# Altium schematic sheet MAX485.SchDoc
size A4
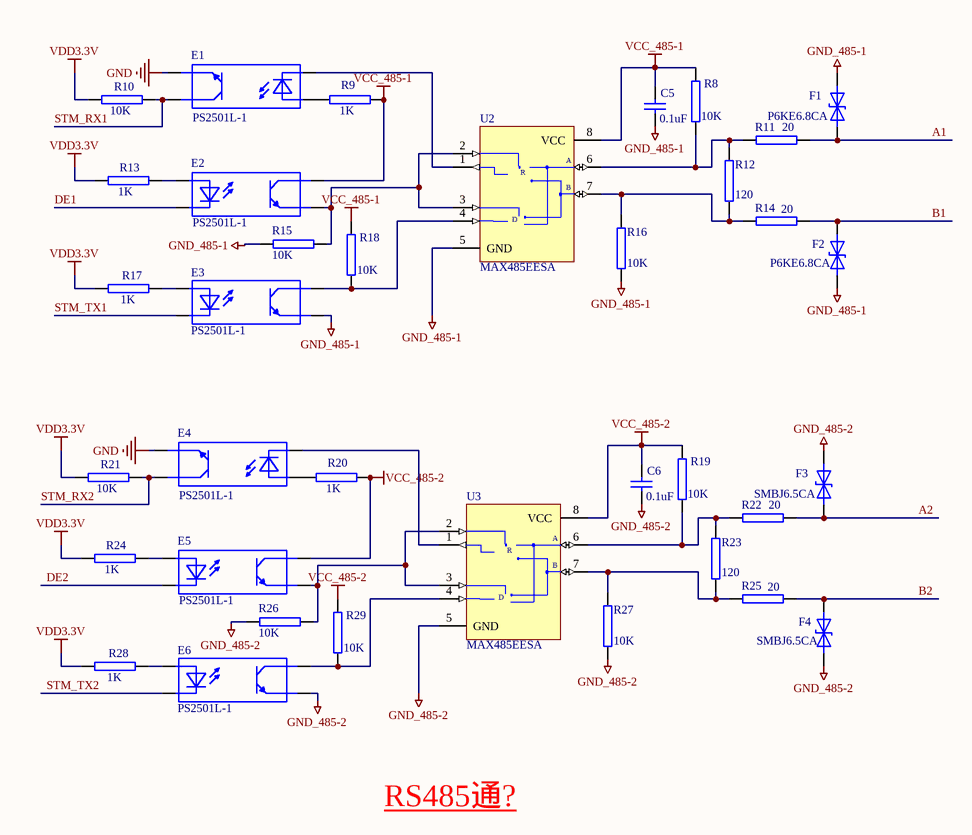
[diagram p0: MAX485.SchDoc]

## Parts
C5  value 0.1uF  [C0805]  (hidden comment: Cap)
C6  value 0.1uF  [C0805]  (hidden comment: Cap)
E1  PS2501L-1  [NEC2501]
E2  PS2501L-1  [NEC2501]
E3  PS2501L-1  [NEC2501]
E4  PS2501L-1  [NEC2501]
E5  PS2501L-1  [NEC2501]
E6  PS2501L-1  [NEC2501]
F1  P6KE6.8CA  [P6KE6,8CA]
F2  P6KE6.8CA  [P6KE6,8CA]
F3  SMBJ6.5CA  [P6KE6,8CA]
F4  SMBJ6.5CA  [P6KE6,8CA]
R8  10K  [0805]
R9  1K  [0805]
R10  10K  [0805]
R11  20  [0805]
R12  120  [0805]
R13  1K  [0805]
R14  20  [0805]
R15  10K  [0805]
R16  10K  [0805]
R17  1K  [0805]
R18  10K  [0805]
R19  10K  [0805]
R20  1K  [0805]
R21  10K  [0805]
R22  20  [0805]
R23  120  [0805]
R24  1K  [0805]
R25  20  [0805]
R26  10K  [0805]
R27  10K  [0805]
R28  1K  [0805]
R29  10K  [0805]
U2  MAX485EESA  [NSO8]
U3  MAX485EESA  [NSO8]

## Nets
GND: E1.3 E4.3
GND_485-1: C5.1 E3.3 F1.1 F2.2 R15.2 R16.1 U2.5(GND)
GND_485-2: C6.1 E6.3 F3.1 F4.2 R26.2 R27.1 U3.5(GND)
VCC_485-1: C5.2 E2.4 R8.2 R9.1 R18.2 U2.8(VCC)
VCC_485-2: C6.2 E5.4 R19.2 R20.1 R29.2 U3.8(VCC)
VDD3.3V: R10.2 R13.2 R17.2 R21.2 R24.2 R28.2
A1: F1.2 R11.2
A2: F3.2 R22.2
B1: F2.1 R14.2
B2: F4.1 R25.2
DE1: E2.2
DE2: E5.2
STM_RX1: E1.4 R10.1
STM_RX2: E4.4 R21.1
STM_TX1: E3.2
STM_TX2: E6.2
NetE1_1: E1.1 R9.2
NetE1_2: E1.2 U2.1(RO)
NetE2_1: E2.1 R13.1
NetE2_3: E2.3 R15.1 U2.2(~{RE}) U2.3(DE)
NetE3_1: E3.1 R17.1
NetE3_4: E3.4 R18.1 U2.4(DI)
NetE4_1: E4.1 R20.2
NetE4_2: E4.2 U3.1(RO)
NetE5_1: E5.1 R24.1
NetE5_3: E5.3 R26.1 U3.2(~{RE}) U3.3(DE)
NetE6_1: E6.1 R28.1
NetE6_4: E6.4 R29.1 U3.4(DI)
NetR8_1: R8.1 R11.1 R12.2 U2.6(A)
NetR12_1: R12.1 R14.1 R16.2 U2.7(B)
NetR19_1: R19.1 R22.1 R23.2 U3.6(A)
NetR23_1: R23.1 R25.1 R27.2 U3.7(B)

## Notes on the sheet
- RS485通?
- (in symbol MAX485ESA) R; D

## Library data of the parts
C5 C6 = Cap: Capacitor; Published: 8-Jun-2000; LatestRevisionDate: 17-Jul-2002; LatestRevisionNote: Re-released for DXP Platform.; Publisher: Altium Limited
E1-E6 = OP: 光耦
F1-F4 = TVS: 快速瞬变二极管
R8-R29 = RES2
U2 U3 = MAX485ESA: Low-Power, Slew-Rate-Limited RS-485/RS-422 Transceiver; Code - JEDEC: MS-012-AA; Code - IPC: SO8; Published: 16-Jan-2001; Revision: 17-Jul-2002: Re-released for DXP Platform.; Datasheet: Latest Revision: Feb-1996; Package Reference: NSO8; Publisher: Altium Limited